# Altium schematic sheet -BLOCK_DIAGRAM_NODE.SchDoc
size A3; SheetNumber: 1; SheetTotal: 3
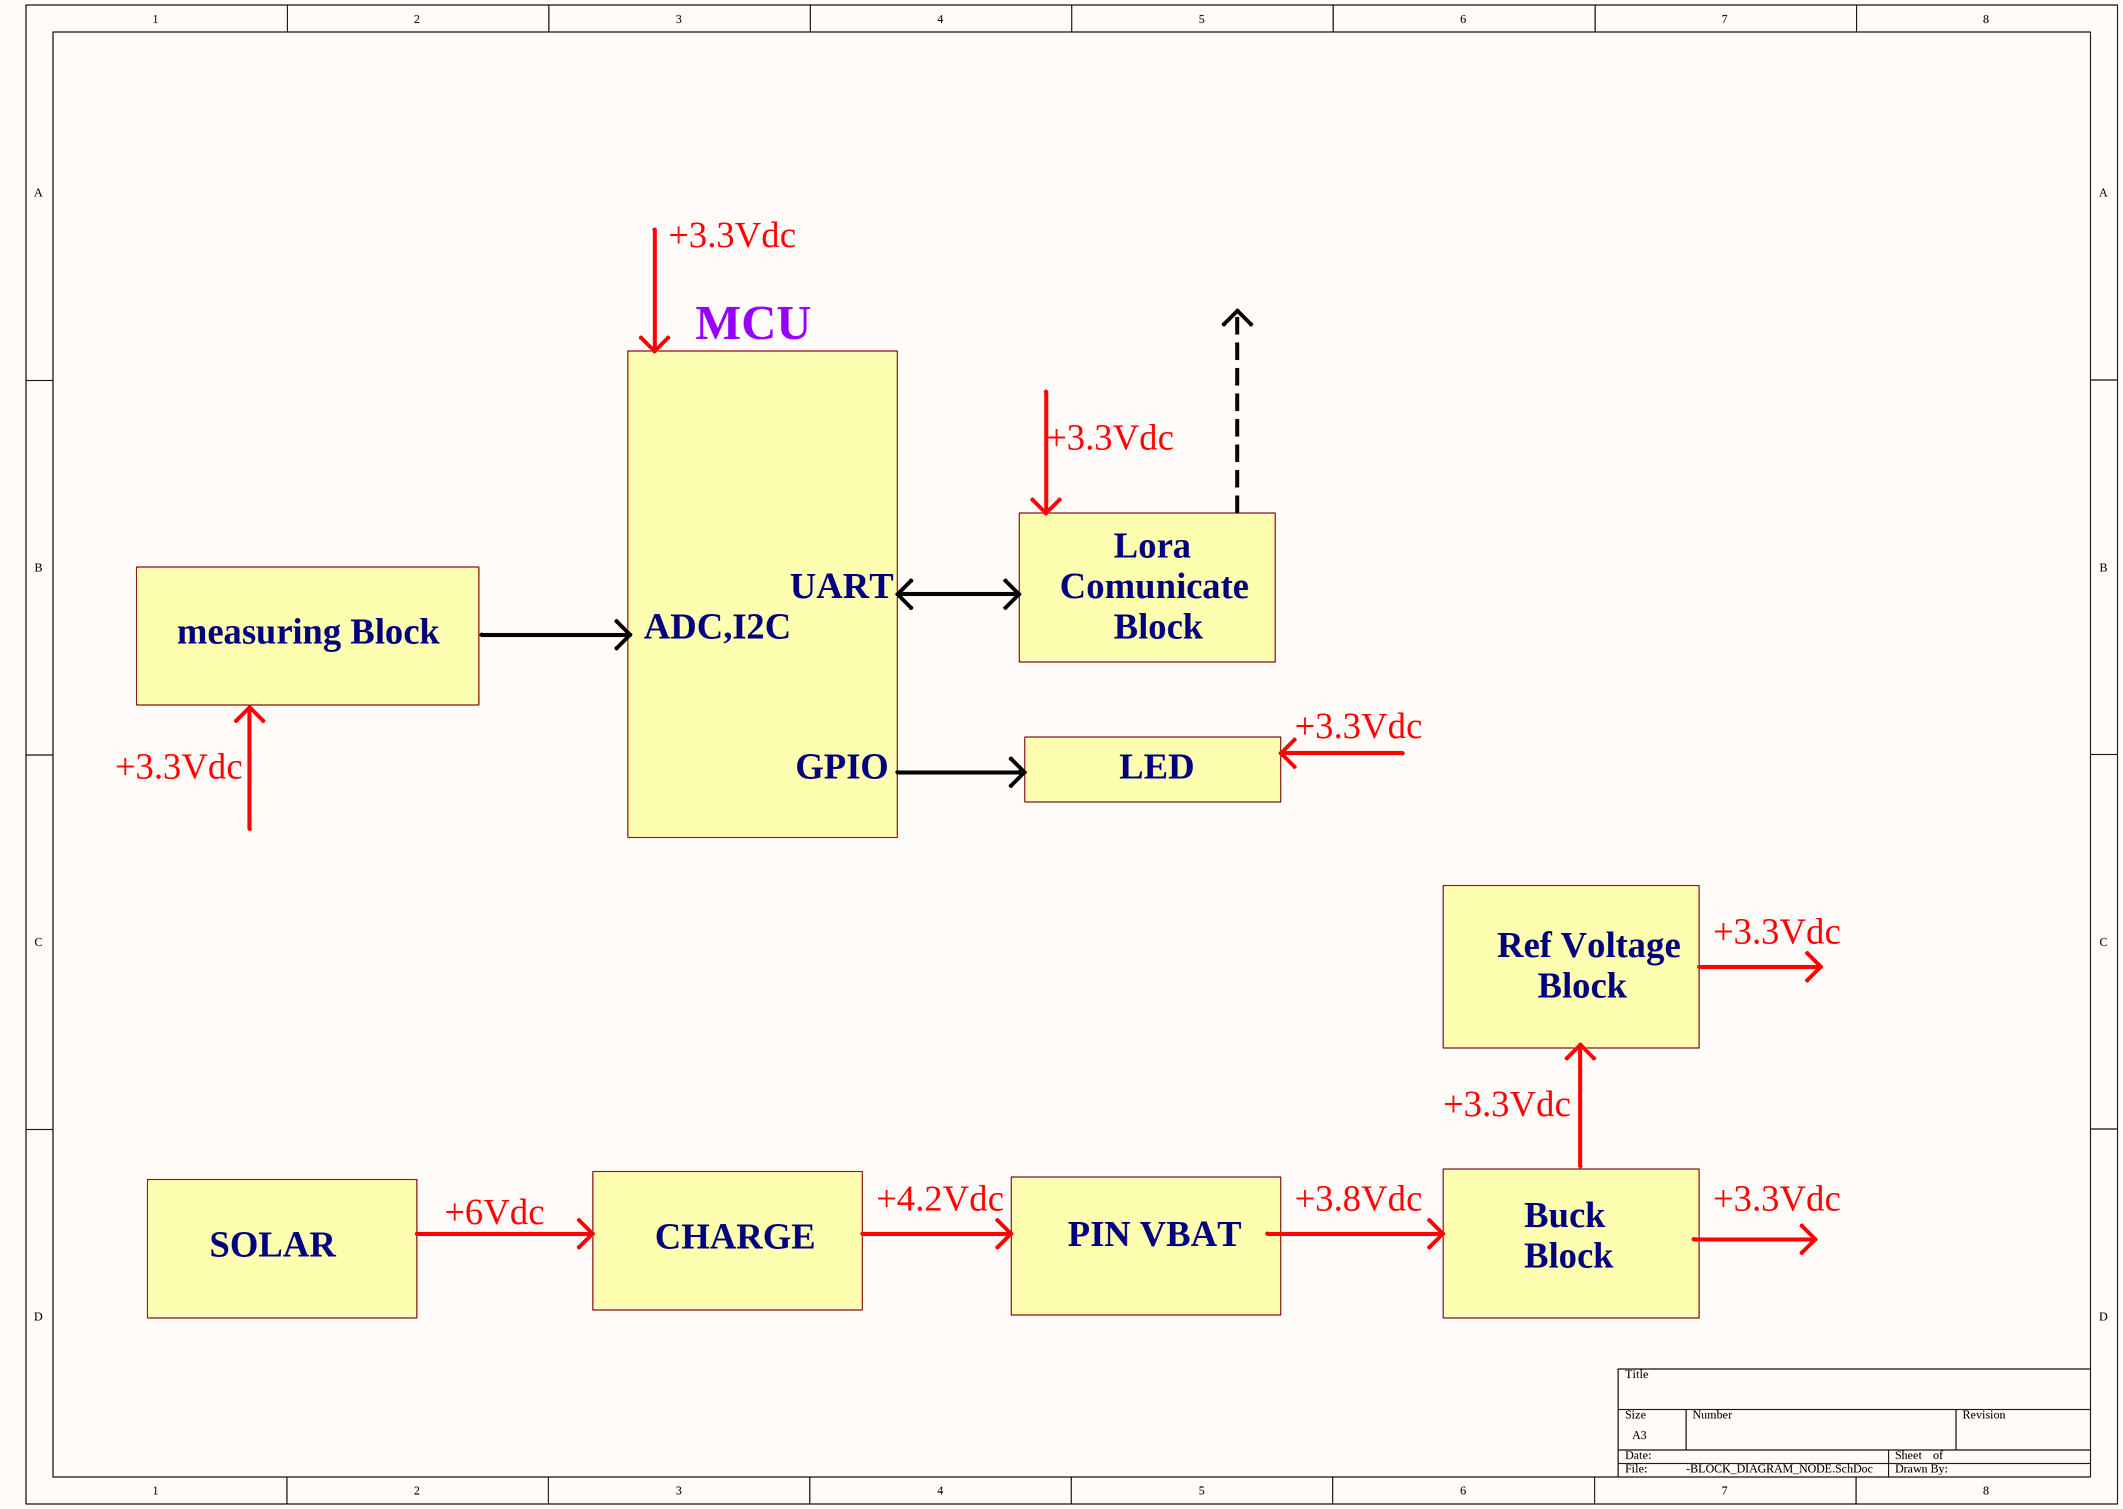
[diagram p0: -BLOCK_DIAGRAM_NODE.SchDoc]

## Notes on the sheet
- +3.3Vdc
- MCU
- Lora
- measuring Block
- ADC,I2C
- UART
- Comunicate
- Block
- GPIO
- LED
- Ref Voltage
- SOLAR
- +6Vdc
- CHARGE
- +4.2Vdc
- PIN VBAT
- +3.8Vdc
- Buck